# EAGLE design act (EAGLE 7.7.0)
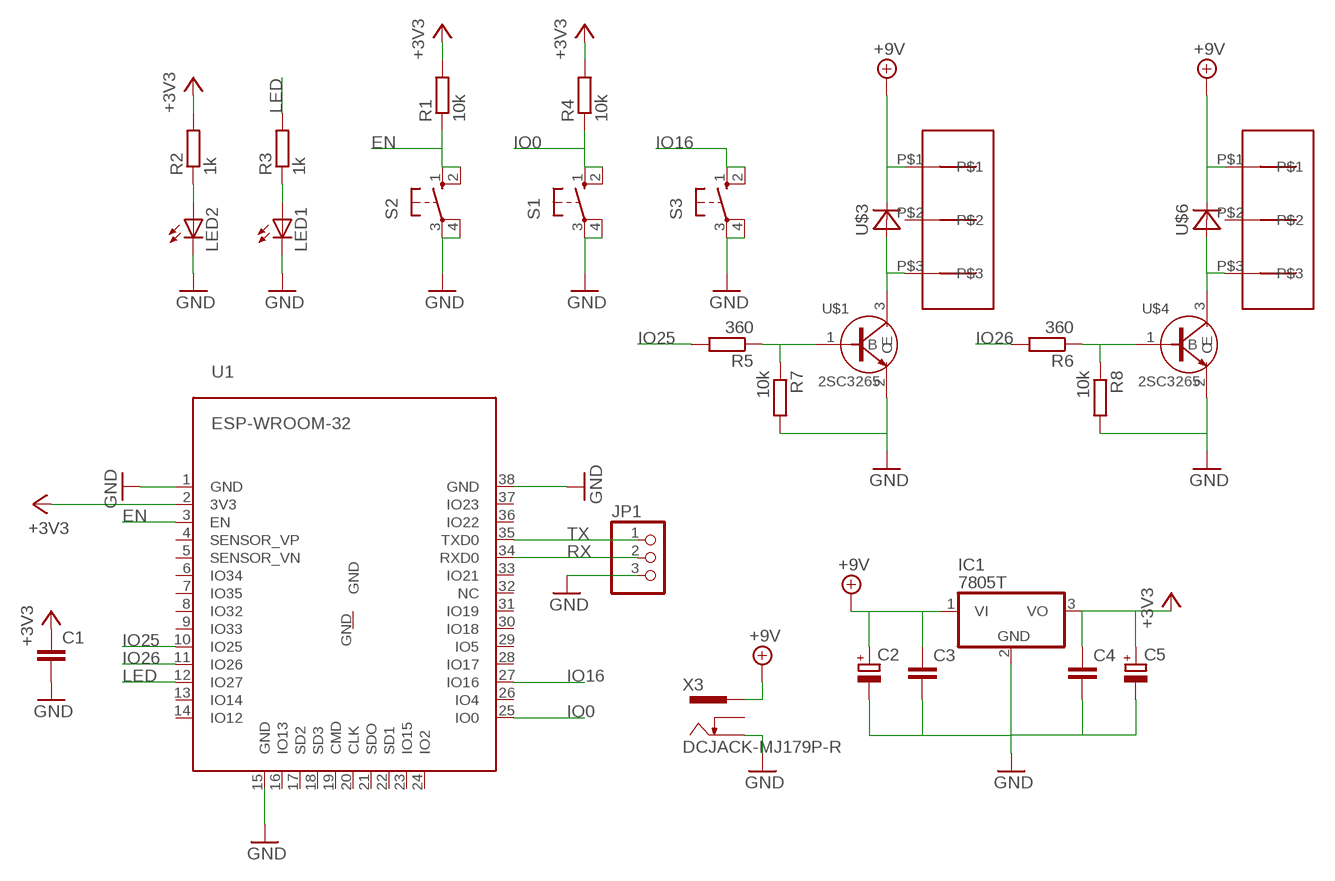
[diagram p0: schematic, sheet 1]

## Parts
C1  C-EU050-024X044  [C050-024X044]
C2  CPOL-EUE5-4  [E5-4]
C3  C-EU050-024X044  [C050-024X044]
C4  C-EU050-024X044  [C050-024X044]
C5  CPOL-EUE5-4  [E5-4]
IC1  7805T  [TO220H]
JP1  PINHD-1X3/90  [1X03/90]
LED1  LEDSML0603  [SML0603]
LED2  LEDSML0603  [SML0603]
R1  10k  R-EU_0207/10  [0207/10]
R2  1k  R-EU_0207/10  [0207/10]
R3  1k  R-EU_0207/10  [0207/10]
R4  10k  R-EU_0207/10  [0207/10]
R5  360  R-EU_0207/10  [0207/10]
R6  360  R-EU_0207/10  [0207/10]
R7  10k  R-EU_0207/10  [0207/10]
R8  10k  R-EU_0207/10  [0207/10]
S1  10-XX  [B3F-10XX]
S2  10-XX  [B3F-10XX]
S3  10-XX  [B3F-10XX]
U1  ESP-WROOM-32  [ESP-WROOM-32]
U$1  2SC3265  [SC-59]
U$2  JST_NH  [JST_NH]
U$3  GP20B  [GP20B]
U$4  2SC3265  [SC-59]
U$5  JST_NH  [JST_NH]
U$6  GP20B  [GP20B]
X3  DCJACK-MJ179P-R  [MJ-179P-R]

## Nets
+3V3: C1.1 C4.1 C5.+ IC1.3(VO) R1.2 R2.2 R4.2 U1.2(3V3)
+5V [VCC]: LED2.A R2.1
+5V1 [VCC]: LED1.A R3.1
+9V [VCC]: C2.+ C3.1 IC1.1(VI) U$2.P$1 U$3.K(C) U$5.P$1 U$6.K(C) X3.1
EN: R1.1 S2.1(S) S2.2(S1) U1.3(EN)
GND: C1.2 C2.- C3.2 C4.2 C5.- IC1.2(GND) JP1.3 LED1.C LED2.C R7.2 R8.2 S1.3(P) S1.4(P1) S2.3(P) S2.4(P1) S3.3(P) S3.4(P1) U1.1(GND) U1.15(GND) U1.38(GND) U$1.2(E) U$4.2(E) X3.2
IO0: R4.1 S1.1(S) S1.2(S1) U1.25(IO0)
IO16: S3.1(S) S3.2(S1) U1.27(IO16)
IO25: R5.2 U1.10(IO25)
IO26: R6.2 U1.11(IO26)
LED: R3.2 U1.12(IO27)
N$1: U$1.3(C) U$2.P$3 U$3.A
N$2: U$4.3(C) U$5.P$3 U$6.A
N$3: R5.1 R7.1 U$1.1(B)
N$4: R6.1 R8.1 U$4.1(B)
RX: JP1.2 U1.34(RXD0)
TX: JP1.1 U1.35(TXD0)
Unconnected: U1.4(SENSOR_VP) U1.5(SENSOR_VN) U1.6(IO34) U1.7(IO35) U1.8(IO32) U1.9(IO33) U1.13(IO14) U1.14(IO12) U1.16(IO13) U1.17(SD2) U1.18(SD3) U1.19(CMD) U1.20(CLK) U1.21(SDO) U1.22(SD1) U1.23(IO15) U1.24(IO2) U1.26(IO4) U1.28(IO17) U1.29(IO5) U1.30(IO18) U1.31(IO19) U1.32(NC) U1.33(IO21) U1.36(IO22) U1.37(IO23) U1.GND U$2.P$2 U$5.P$2 X3.3

## Library data of the parts
C1 C3 C4 = rcl:C-EU: CAPACITOR, European symbol
C2 C5 = rcl:CPOL-EU: POLARIZED CAPACITOR, European symbol
IC1 = linear4:78*: Positive VOLTAGE REGULATOR
JP1 = pinhead:PINHD-1X3: PIN HEADER
LED1 LED2 = led:LED: LED OSRAM: - CHIPLED LG R971, LG N971, LY N971, LG Q971, LY Q971, LO R971, LY R971 LH N974, LH R974 LS Q976, LO Q976, LY Q976 LO Q996 - Hyper CHIPLED LW Q18S LB Q993, LB Q99A, LB R99A - SideLED LS A670, LO A670, LY A670, LG A670, LP A670 LB A673, LV A673, LT A673, LW A673 LH A674 LY A675 LS A676, LA A676, LO A676, LY A676, LW A676 LS A679, LY A679, LG A679 - Hyper Micro SIDELED® LS Y876, LA Y876, LO Y876, LY Y876 LT Y87S - SmartLED LW L88C, LW L88S LB L89C, LB L89S, LG L890 LS L89K, LO L89K, LY L89K LS L896, LA L896, LO L896, LY L896 - TOPLED LS T670, LO T670, LY T670, LG T670, LP T670 LSG T670, LSP T670, LSY T670, LOP T670, LYG T670 LG T671, LOG T671, LSG T671 LB T673, LV T673, LT T673, LW T673 LH T674 LS T676, LA T676, LO T676, LY T676, LB T676, LH T676, LSB T676, LW T676 LB T67C, LV T67C, LT T67C, LS T67K, LO T67K, LY T67K, LW E67C LS E67B, LA E67B, LO E67B, LY E67B, LB E67C, LV E67C, LT E67C LW T67C LS T679, LY T679, LG T679 LS T770, LO T770, LY T770, LG T770, LP T770 LB T773, LV T773, LT T773, LW T773 LH T774 LS E675, LA E675, LY E675, LS T675 LS T776, LA T776, LO T776, LY T776, LB T776 LHGB T686 LT T68C, LB T68C - Hyper Mini TOPLED® LB M676 - Mini TOPLED Santana® LG M470 LS M47K, LO M47K, LY M47K Source: http://www.osram.convergy.de LUXEON: - LUMILED® LXK2-PW12-R00, LXK2-PW12-S00, LXK2-PW14-U00, LXK2-PW14-V00 LXK2-PM12-R00, LXK2-PM12-S00, LXK2-PM14-U00 LXK2-PE12-Q00, LXK2-PE12-R00, LXK2-PE12-S00, LXK2-PE14-T00, LXK2-PE14-U00 LXK2-PB12-K00, LXK2-PB12-L00, LXK2-PB12-M00, LXK2-PB14-N00, LXK2-PB14-P00, LXK2-PB14-Q00 LXK2-PR12-L00, LXK2-PR12-M00, LXK2-PR14-Q00, LXK2-PR14-R00 LXK2-PD12-Q00, LXK2-PD12-R00, LXK2-PD12-S00 LXK2-PH12-R00, LXK2-PH12-S00 LXK2-PL12-P00, LXK2-PL12-Q00, LXK2-PL12-R00 Source: www.luxeon.com KINGBRIGHT: KA-3528ASYC Source: www.kingbright.com
R1-R8 = rcl:R-EU_: RESISTOR, European symbol
S1-S3 = switch-omron:10-XX: OMRON SWITCH; MPN: B3F-1000; OC_FARNELL: 176432; OC_NEWARK: 36M3542
U1 = esp32:ESP-WROOM-32
U$1 U$4 = 2sc3265:2SC3265
U$2 U$5 = jst_nh:JST_NH
U$3 U$6 = gp20b:GP20B
X3 = akizuki-dcjack:DCJACK: DC JACK 2.1mmφ - 5.5mmφ DCジャック、基板用。

## Board
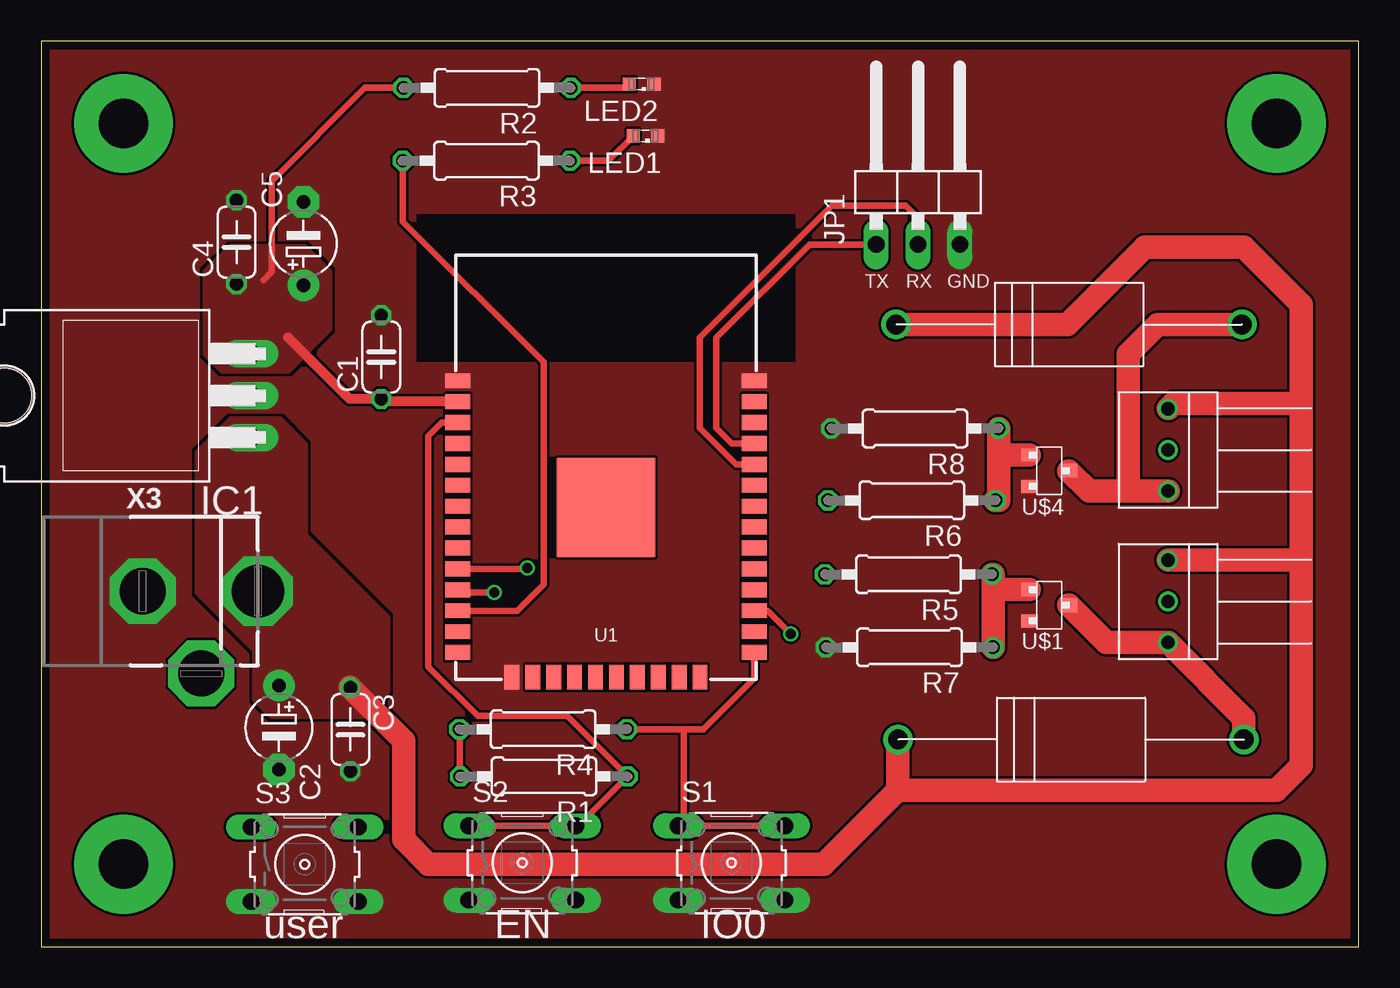
[diagram p1: board, top side]
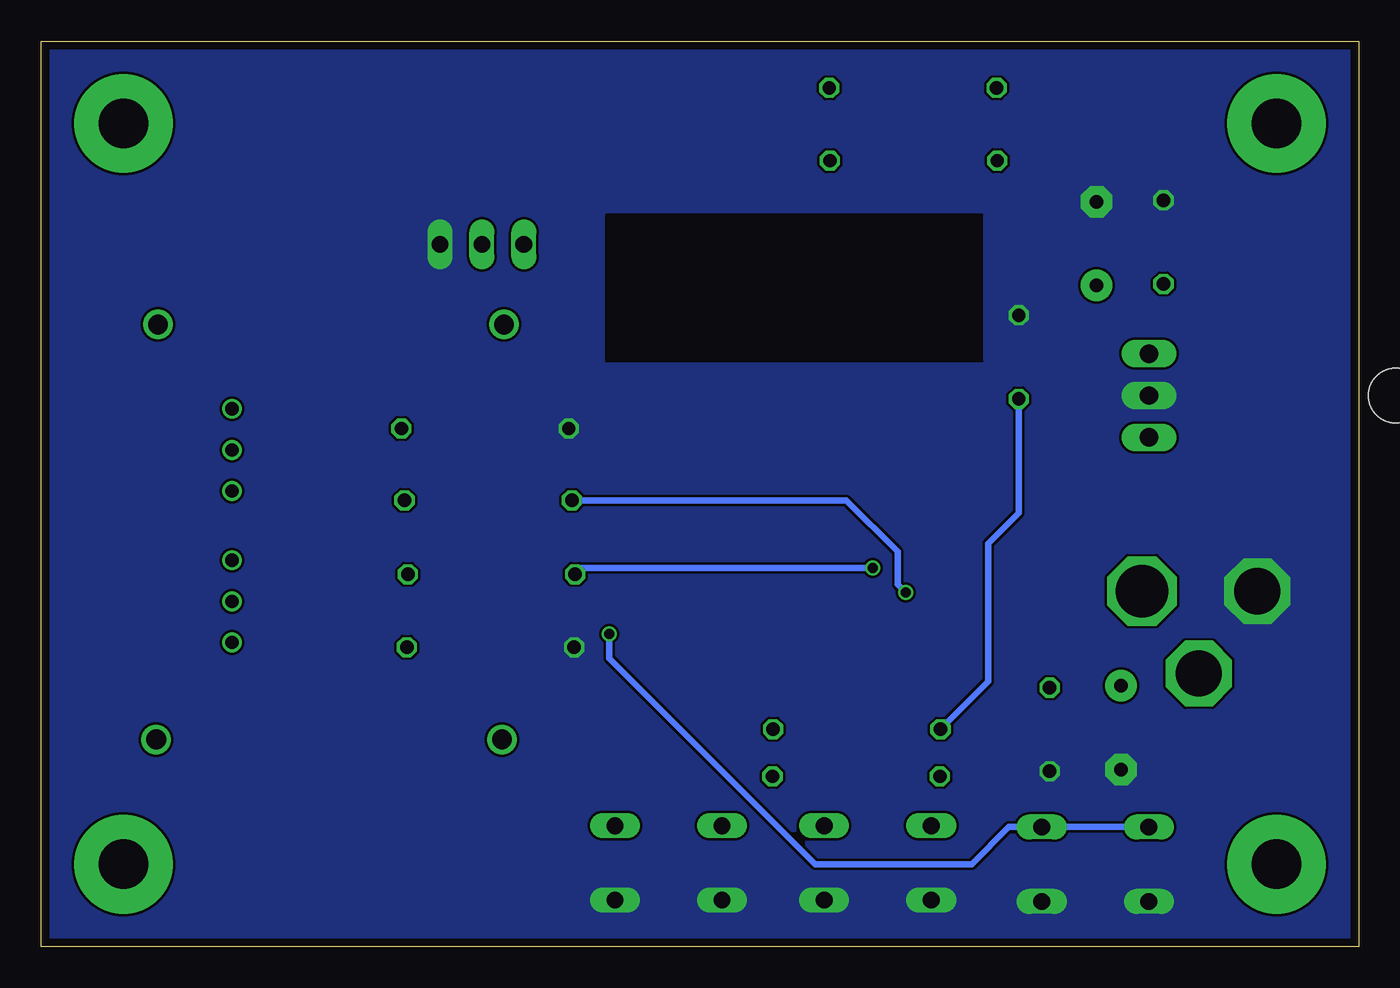
[diagram p2: board, bottom side, seen from below]

Size 80 x 55 mm. Coordinates in mm from the lower left corner, seen from the top.
Outline: 0,0 80,0 80,55 0,55 0,0
Copper layers (1*16): Top 0.035mm / dielectric 1.6mm / Bottom 0.035mm
Design rules "Elecrow_2-layer_PCB_eagle_rule": minimum track width 6mil, minimum drill 12mil, track to track 6mil, track to pad 6mil, pad to pad 6mil, via to via 8mil, smd to smd 0mil, copper to edge 20mil, drill to drill 10mil, minimum pad ring 6mil, minimum via ring 6mil, stop-mask expansion 0mil, vias tented up to drill 100mil, thermal gap 10mil

### Footprints (pad centres in the part's own frame; a part is rotated, then mirrored left to right if it is on the bottom)
C050-024X044 = drill 0.813 octagon: 1 -2.54,0; 2 2.54,0
E5-4 = drill 0.813 pad 1.905: + -2.54,0 | drill 0.813 pad 1.905 octagon: - 2.54,0
TO220H = drill 1.118 long: 1 -2.54,-10.16; 2 0,-10.16; 3 2.54,-10.16 | hole 3.302: 0,4.826
1X03/90 = drill 1.016 long: 1 -2.54,-3.81; 2 0,-3.81; 3 2.54,-3.81
SML0603 = smd 0.8 x 0.8: A 0.75,0; C -0.75,0
0207/10 = drill 0.813 octagon: 1 -5.08,0; 2 5.08,0
B3F-10XX = drill 1.016 long: 1 -3.251,2.261; 2 3.251,2.261; 3 -3.251,-2.261; 4 3.251,-2.261
ESP-WROOM-32 = smd 0.9 x 1.5: 1 7.7,9; 2 6.43,9; 3 5.16,9; 4 3.89,9; 5 2.62,9; 6 1.35,9; 7 0.08,9; 8 -1.19,9; 9 -2.46,9; 10 -3.73,9; 11 -5,9; 12 -6.27,9; 13 -7.54,9; 14 -8.81,9; 25 -8.81,-9; 26 -7.54,-9; 27 -6.27,-9; 28 -5,-9; 29 -3.73,-9; 30 -2.46,-9; 31 -1.19,-9; 32 0.08,-9; 33 1.35,-9; 34 2.62,-9; 35 3.89,-9; 36 5.16,-9; 37 6.43,-9; 38 7.7,-9 | smd 1.5 x 0.9: 15 -10.3,5.715; 16 -10.3,4.445; 17 -10.3,3.175; 18 -10.3,1.905; 19 -10.3,0.635; 20 -10.3,-0.635; 21 -10.3,-1.905; 22 -10.3,-3.175; 23 -10.3,-4.445; 24 -10.3,-5.715 | smd 6 x 6: GND 0,0
SC-59 = smd 0.8 x 1: 1 -0.95,-1.2; 2 0.95,-1.2; 3 0,1.2
JST_NH = drill 0.8: P$1 -2.5,-1.905; P$2 0,-1.905; P$3 2.5,-1.905
GP20B = drill 1.2: A 0,0; K 0,21
MJ-179P-R = drill 3.2 pad 4 octagon: 1 3,0 | drill 2.8 pad 4 octagon: 2 -4,0; 3 -0.45,-5

### Placement (x,y rotation side)
C1  20.65,35.81 90 top
C2  14.43,13.3 270 top
C3  18.77,13.19 270 top
C4  11.86,42.79 90 top
C5  15.92,42.7 90 top
IC1  2.59,33.47 90 top
JP1  53.24,46.46 0 top
LED1  36.69,49.24 180 top
LED2  36.46,52.39 180 top
R1  30.52,10.34 180 top
R2  27.07,52.16 180 top
R3  27.03,47.74 180 top
R4  30.48,13.2 180 top
R5  52.66,22.61 180 top
R6  52.86,27.11 180 top
R7  52.72,18.18 180 top
R8  53.05,31.47 180 top
S1  41.91,5.08 0 top
S2  29.21,5.08 0 top
S3  16,5 0 top
U1  34.29,26.67 90 top
U$1  61.2,20.74 270 top
U$2  70.32,20.97 270 top
U$3  73.02,12.58 90 top
U$4  61.2,28.9 270 top
U$5  70.32,30.17 270 top
U$6  72.9,37.79 90 top
X3  10.16,21.59 0 top

### Tracks (layer width: path | path; a pad name or v marks a point on that pad's centre or on a via)
+3V3
  Top 0.406: R2.2 19.66,52.16 14,46.5 14,41 13.5,40.5 | R1.2 25.4,10.38 R4.2
  Top 0.61: U1.2 20.65,33.1 C1.1 18.73,33.27 15,37
  Bottom 0.406: R4.2 22.5,16.1 22.5,24.5 20.65,26.35 C1.1
  pour Top (no thermals): 11,35 15,35 17.5,37.5 17.5,41 16,42.5 11.5,42.5 10,41 10,37 10,36
+5V
  Top 0.406: R2.1 35.48,52.16 LED2.A
+5V1
  Top 0.406: R3.1 34.44,47.74 LED1.A
+9V
  Top 1.422: C3.1 22,12.5 22,6.5 23.5,5 47.5,5 52,9.5 52.02,9.5 | 52.02,9.5 75,9.5 76.5,11 76.5,23.47 | 76.5,23.47 76.5,33 | 76.5,33 76.5,39 73,42.5 67,42.5 62.29,37.79 U$6.K | U$5.P$1 68.75,33 76.5,33 | U$2.P$1 76.5,23.47 | 52.02,9.5 U$3.K
  pour Top (no thermals): 9.5,21.5 13,18 13,15 14,14 19.5,14 21,15.5 21,20 16,25 16,30.5 14.5,32 11.5,32 9.5,30
EN
  Top 0.406: S2.1 S2.2 32.6,7.34 R1.1 31.94,14 26.5,14 23.5,17 23.5,31 24.33,31.83 U1.3
GND
  pour Top (rank 6, no thermals): -8.89,62.17 -8.89,-11.43 88.49,-11.43 88.49,62.17
  pour Bottom (rank 6, no thermals): -6.35,59.63 -6.35,-6.35 84.68,-6.35 84.68,59.63
IO0
  Top 0.406: R4.1 39,13.2 | 39,13.2 40.2,13.2 43.29,16.29 U1.25 | S1.1 39,7.68 | 39,7.68 39,13.2 | 39,7.68 39.34,7.34 S1.2
IO16  (via drill 0.6)
  Top 0.406: v45.5,19 44.1,20.4 U1.27
  Bottom 0.406: S3.1 S3.2 21.24,7.26 23.5,5 33,5 45.5,17.5 v45.5,19
IO25  (via drill 0.6)
  Top 0.406: U1.10 29.44,22.94 v29.5,23
  Bottom 0.406: v29.5,23 47.19,23 R5.2
IO26  (via drill 0.6)
  Top 0.406: U1.11 25.46,21.5 v27.5,21.5
  Bottom 0.406: v27.5,21.5 28,22 28,24 31.11,27.11 R6.2
LED
  Top 0.406: R3.2 21.95,44.05 30.5,35.5 30.5,22 28.9,20.4 U1.12
N$1
  Top 1.422: U$1.3 64.67,18.47 U$2.P$3 73.02,13.87 U$3.A
N$2
  Top 1.422: U$4.3 63.63,27.67 66,27.67 | 66,27.67 U$5.P$3 | U$6.A 67.79,37.79 66,36 66,27.67
N$3
  Top 1.422: U$1.1 57.8,21.69 | 57.8,21.69 57.8,21 R7.1 | R5.1 57.8,22.61 57.8,21.69
N$4
  Top 1.422: U$4.1 58.13,29.85 | 58.13,29.85 58.13,30.5 R8.1 | R6.1 58.13,27.11 58.13,29.85
N$5  (via drill 3 pad 6)
  other vias: 5,5
N$6  (via drill 3 pad 6)
  other vias: 5,50
N$7  (via drill 3 pad 6)
  other vias: 75,50
N$8  (via drill 3 pad 6)
  other vias: 75,5
RX
  Top 0.406: U1.34 42.21,29.29 40,31.5 40,37 48,45 52.5,45 53.24,44.26 JP1.2
TX
  Top 0.406: U1.35 41.94,30.56 41,31.5 41,37 46.65,42.65 JP1.1

### Text on the board
tPlace: TX | RX | GND | user | EN | IO0